# EAGLE design schemat (EAGLE 9.6.2)
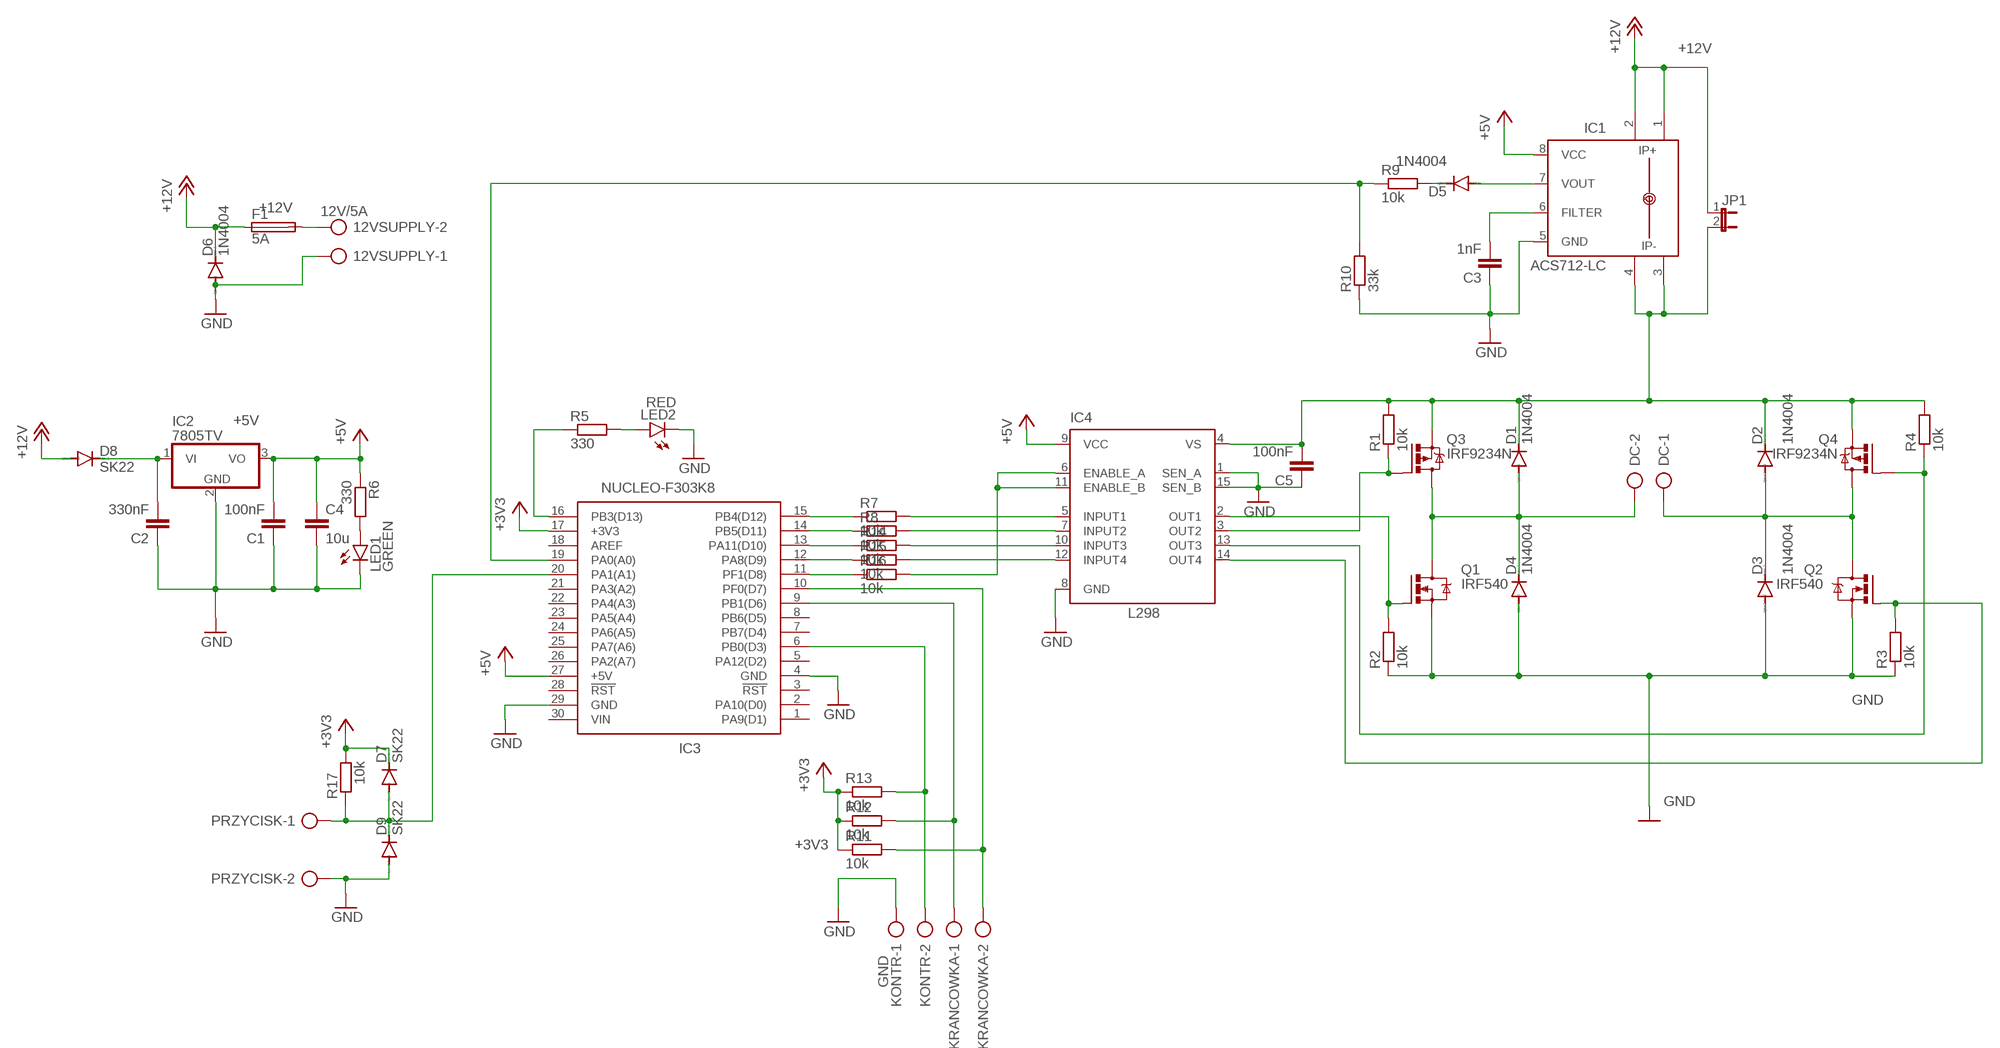
[diagram p0: schematic, sheet 1]

## Parts
12VSUPPLY  12V/5A  AK500/2-H  [AK500/2-H]
C1  100nF  C2.5/2  [C2.5-2]
C2  330nF  C2.5/2  [C2.5-2]
C3  1nF  C-EU025-024X044  [C025-024X044]
C4  10u  C-EU025-024X044  [C025-024X044]
C5  100nF  C2.5/2  [C2.5-2]
D1  1N4004  [DO41-10]
D2  1N4004  [DO41-10]
D3  1N4004  [DO41-10]
D4  1N4004  [DO41-10]
D5  1N4004  [DO41-10]
D6  1N4004  [DO41-10]
D7  SK22  ES2D  [SMB]
D8  SK22  ES2D  [SMB]
D9  SK22  ES2D  [SMB]
DC  AK500/2-H  [AK500/2-H]
F1  5A  TR5  [TR5]
IC1  ACS712-LC  [SOIC8]
IC2  7805TV  [TO220V]
IC3  NUCLEO-F303K8  [DIPS1524W66P254L5029H1500Q30N]
IC4  L298  [MULTIWATT-15]
JP1  JP1E  [JP1]
KONTR  GND  AK500/2-H  [AK500/2-H]
KRANCOWKA  AK500/2-H  [AK500/2-H]
LED1  GREEN  LED3MM  [LED3MM]
LED2  RED  LED3MM  [LED3MM]
PRZYCISK  AK500/2-H  [AK500/2-H]
Q1  IRF540  [TO220BV]
Q2  IRF540  [TO220BV]
Q3  IRF9234N  IRF9530  [TO220BV]
Q4  IRF9234N  IRF9530  [TO220BV]
R1  10k  R-EU_R1206  [R1206]
R2  10k  R-EU_R1206  [R1206]
R3  10k  R-EU_R1206  [R1206]
R4  10k  R-EU_R1206  [R1206]
R5  330  R-EU_R1206  [R1206]
R6  330  R-EU_R1206  [R1206]
R7  10k  R-EU_R1206  [R1206]
R8  10k  R-EU_R1206  [R1206]
R9  10k  R-EU_R1206  [R1206]
R10  33k  R-EU_R1206  [R1206]
R11  10k  R-EU_R1206  [R1206]
R12  10k  R-EU_R1206  [R1206]
R13  10k  R-EU_R1206  [R1206]
R14  10k  R-EU_R1206  [R1206]
R15  10k  R-EU_R1206  [R1206]
R16  10k  R-EU_R1206  [R1206]
R17  10k  R-EU_R1206  [R1206]

## Nets
+3V3: D7.C IC3.17(+3V3) R11.1 R12.1 R13.1 R17.2
+5V: C1.2 C4.1 IC1.8(VCC) IC2.3(VO) IC3.27(+5V) IC4.9(VCC) R6.1
+12V: D6.C D8.A F1.1 IC1.1(IP+) IC1.2(IP+1) JP1.1
GND: 12VSUPPLY.1 C1.1 C2.1 C3.1 C4.2 C5.1 D3.A D4.A D6.A D9.A IC1.5(GND) IC2.2(GND) IC3.4(GND) IC3.29(GND) IC4.1(SEN_A) IC4.8(GND) IC4.15(SEN_B) KONTR.1 LED1.K(C) LED2.K(C) PRZYCISK.2 Q1.S Q2.S R2.1 R3.1 R10.1
N$1: D2.A D3.C DC.1 Q2.D Q4.D
N$2: D1.A D4.C DC.2 Q1.D Q3.D
N$3: IC3.15(PB4(D12)) R7.1
N$4: IC4.5(INPUT1) R7.2
N$5: IC4.2(OUT1) Q1.G R2.2
N$6: IC4.14(OUT4) Q2.G R3.2
N$7: IC3.19(PA0(A0)) R9.1 R10.2
N$8: C2.2 D8.C IC2.1(VI)
N$9: IC4.3(OUT2) Q3.G R1.1
N$10: C5.2 D1.C D2.C IC1.3(IP-) IC1.4(IP-1) IC4.4(VS) JP1.2 Q3.S Q4.S R1.2 R4.2
N$11: IC4.13(OUT3) Q4.G R4.1
N$12: D5.A IC1.7(VOUT)
N$13: C3.2 IC1.6(FILTER)
N$14: D5.C R9.2
N$15: IC4.7(INPUT2) R8.2
N$16: IC3.14(PB5(D11)) R8.1
N$17: IC4.6(ENABLE_A) IC4.11(ENABLE_B) R16.2
N$19: IC3.6(PB0(D3)) KONTR.2 R13.2
N$20: IC3.9(PB1(D6)) KRANCOWKA.1 R12.2
N$21: IC3.10(PF0(D7)) KRANCOWKA.2 R11.2
N$22: LED1.A R6.2
N$23: IC3.13(PA11(D10)) R14.1
N$24: IC4.10(INPUT3) R14.2
N$25: IC4.12(INPUT4) R15.2
N$26: IC3.12(PA8(D9)) R15.1
N$27: IC3.11(PF1(D8)) R16.1
N$28: IC3.16(PB3(D13)) R5.1
N$29: LED2.A R5.2
N$31: 12VSUPPLY.2 F1.2
N$32: D7.A D9.C IC3.20(PA1(A1)) PRZYCISK.1 R17.1
Unconnected: IC3.1(PA9(D1)) IC3.2(PA10(D0)) IC3.3(!RST) IC3.5(PA12(D2)) IC3.7(PB7(D4)) IC3.8(PB6(D5)) IC3.18(AREF) IC3.21(PA3(A2)) IC3.22(PA4(A3)) IC3.23(PA5(A4)) IC3.24(PA6(A5)) IC3.25(PA7(A6)) IC3.26(PA2(A7)) IC3.28(!RST) IC3.30(VIN)

## Library data of the parts
12VSUPPLY DC KONTR KRANCOWKA PRZYCISK = con-ptr500:AK500/2-H: CONNECTOR Aug. 2004 / PTR Meßtechnik: Die Bezeichnung der Serie AK505 wurde geändert. Es handelt sich hierbei um AK500 in horizontaler Ausführung.; OC_FARNELL: unknown; OC_NEWARK: unknown
C1 C2 C5 = capacitor-wima:C: CAPACITOR naming: grid - package width
C3 C4 = rcl:C-EU: CAPACITOR, European symbol; SPICEPREFIX: C
D1-D6 = diode:1N4004: DIODE general purpose rectifier, 1 A
D7-D9 = diode:ES2D: DIODE super fast rectifier, 2 A
F1 = fuse:TR5: FUSE Wickmann; OC_FARNELL: unknown; OC_NEWARK: unknown
IC1 = allegro-2:ACS712-LC
IC2 = linear:78*: Positive VOLTAGE REGULATOR Source: http://cache.national.com/ds/LM/LM78L05.pdf http://www.fairchildsemi.com/ds/LM/LM7805.pdf
IC3 = NUCLEO-F303K8:NUCLEO-F303K8: STM32 Nucleo-32 development board Source: Datasheet <http://www.st.com/content/ccc/resource/technical/document/data_brief/b1/d8/13/d4/b0/b7/4b/6e/DM00214578.pdf/files/DM00214578.pdf/jcr:content/translations/en.DM00214578.pdf>; ARROW_PART_NUMBER: NUCLEO-F303K8; ARROW_PRICE-STOCK: https://www.arrow.com/en/products/nucleo-f303k8/stmicroelectronics; DESCRIPTION: STM32 Nucleo-32 development board; HEIGHT: 15mm; MANUFACTURER_NAME: STMicroelectronics; MANUFACTURER_PART_NUMBER: NUCLEO-F303K8; RS_PART_NUMBER: 9092862; RS_PRICE-STOCK: http://uk.rs-online.com/web/p/products/9092862
IC4 = st-microelectronics:L298: DUAL FULL-BRIDGE DRIVER; MPN: L298N; OC_FARNELL: 1589425; OC_NEWARK: 32M1527
JP1 = jumper:JP1E: JUMPER
LED1 LED2 = led:LED: LED OSRAM: - CHIPLED LG R971, LG N971, LY N971, LG Q971, LY Q971, LO R971, LY R971 LH N974, LH R974 LS Q976, LO Q976, LY Q976 LO Q996 - Hyper CHIPLED LW Q18S LB Q993, LB Q99A, LB R99A - SideLED LS A670, LO A670, LY A670, LG A670, LP A670 LB A673, LV A673, LT A673, LW A673 LH A674 LY A675 LS A676, LA A676, LO A676, LY A676, LW A676 LS A679, LY A679, LG A679 - Hyper Micro SIDELED® LS Y876, LA Y876, LO Y876, LY Y876 LT Y87S - SmartLED LW L88C, LW L88S LB L89C, LB L89S, LG L890 LS L89K, LO L89K, LY L89K LS L896, LA L896, LO L896, LY L896 - TOPLED LS T670, LO T670, LY T670, LG T670, LP T670 LSG T670, LSP T670, LSY T670, LOP T670, LYG T670 LG T671, LOG T671, LSG T671 LB T673, LV T673, LT T673, LW T673 LH T674 LS T676, LA T676, LO T676, LY T676, LB T676, LH T676, LSB T676, LW T676 LB T67C, LV T67C, LT T67C, LS T67K, LO T67K, LY T67K, LW E67C LS E67B, LA E67B, LO E67B, LY E67B, LB E67C, LV E67C, LT E67C LW T67C LS T679, LY T679, LG T679 LS T770, LO T770, LY T770, LG T770, LP T770 LB T773, LV T773, LT T773, LW T773 LH T774 LS E675, LA E675, LY E675, LS T675 LS T776, LA T776, LO T776, LY T776, LB T776 LHGB T686 LT T68C, LB T68C - Hyper Mini TOPLED® LB M676 - Mini TOPLED Santana® LG M470 LS M47K, LO M47K, LY M47K Source: http://www.osram.convergy.de LUXEON: - LUMILED® LXK2-PW12-R00, LXK2-PW12-S00, LXK2-PW14-U00, LXK2-PW14-V00 LXK2-PM12-R00, LXK2-PM12-S00, LXK2-PM14-U00 LXK2-PE12-Q00, LXK2-PE12-R00, LXK2-PE12-S00, LXK2-PE14-T00, LXK2-PE14-U00 LXK2-PB12-K00, LXK2-PB12-L00, LXK2-PB12-M00, LXK2-PB14-N00, LXK2-PB14-P00, LXK2-PB14-Q00 LXK2-PR12-L00, LXK2-PR12-M00, LXK2-PR14-Q00, LXK2-PR14-R00 LXK2-PD12-Q00, LXK2-PD12-R00, LXK2-PD12-S00 LXK2-PH12-R00, LXK2-PH12-S00 LXK2-PL12-P00, LXK2-PL12-Q00, LXK2-PL12-R00 Source: www.luxeon.com KINGBRIGHT: KA-3528ASYC Source: www.kingbright.com
Q1 Q2 = transistor-power:IRF540: HEXFET Power MOSFET
Q3 Q4 = transistor-power:IRF9530: P-CHANNEL HEXFET POWER-MOS-FET Source: http://www.irf.com/product-info/datasheets/data/irf9530.pdf
R1-R17 = rcl:R-EU_: RESISTOR, European symbol; SPICEPREFIX: R

## Board
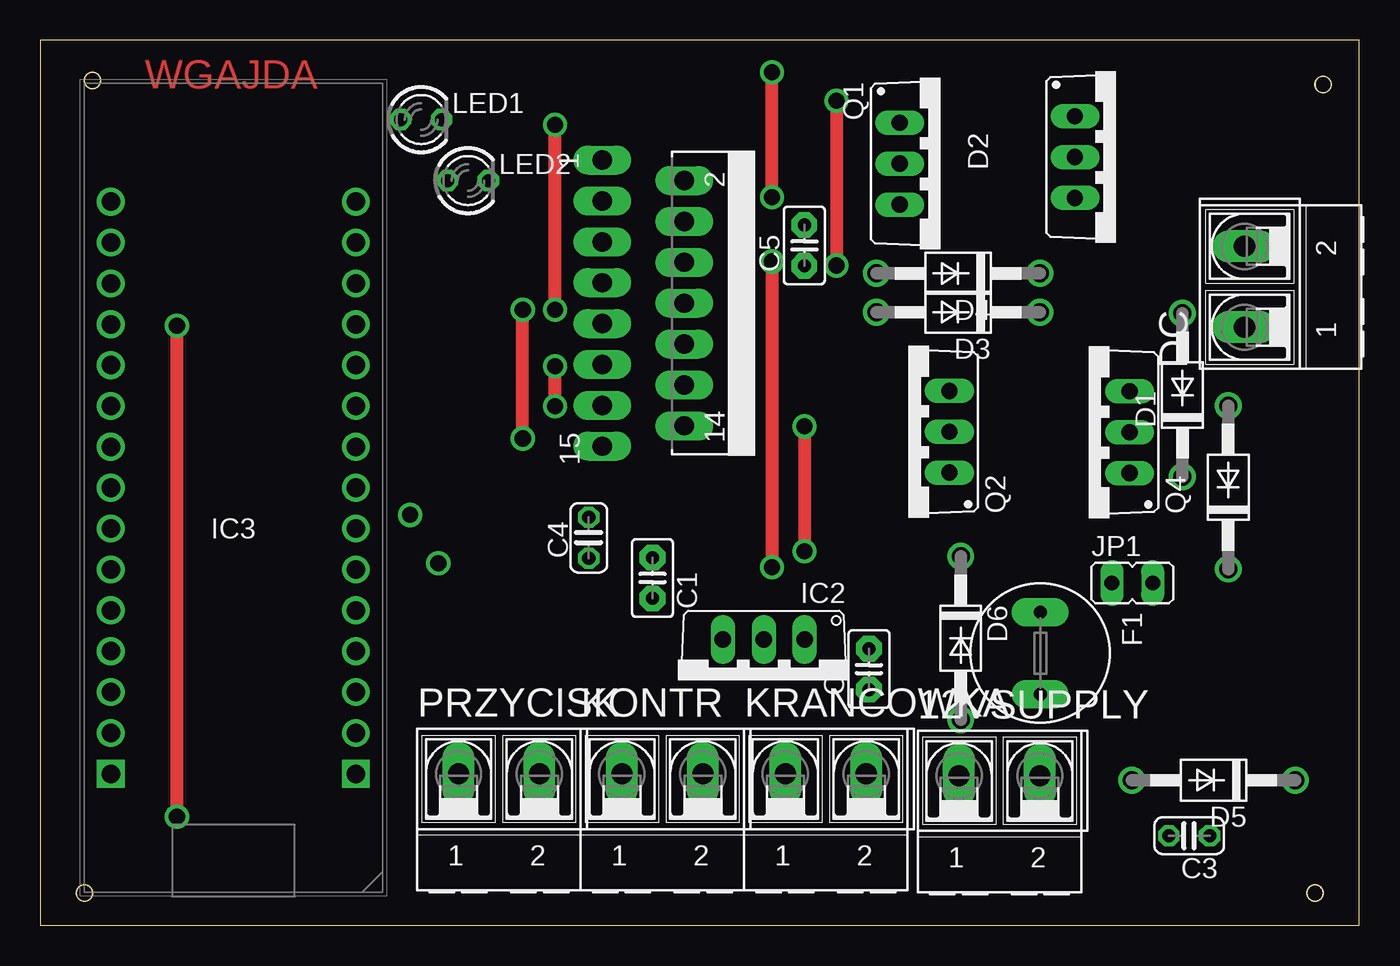
[diagram p1: board, top side]
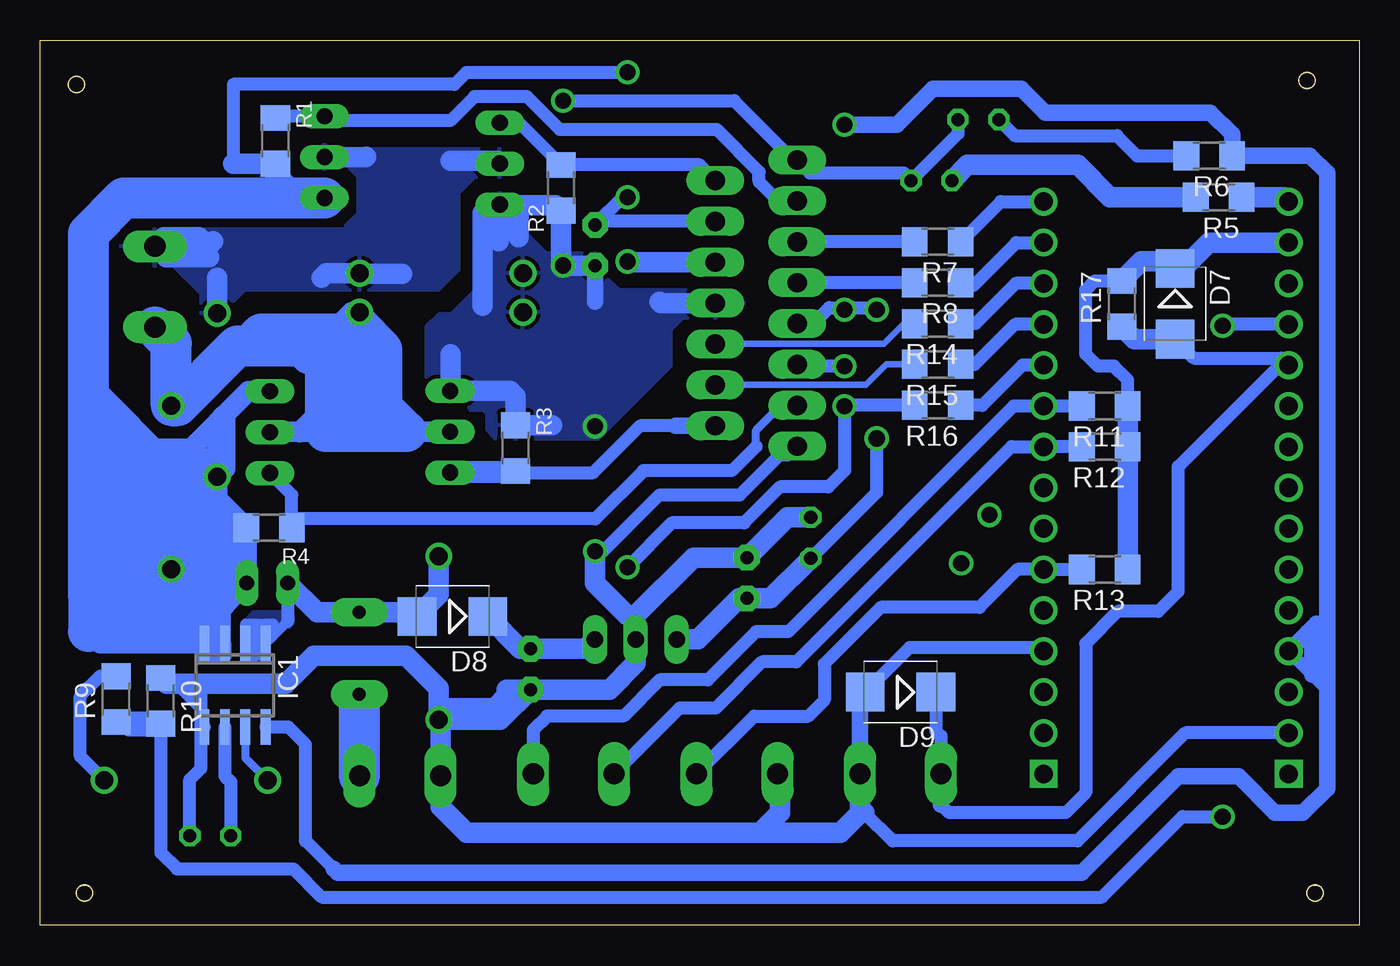
[diagram p2: board, bottom side, seen from below]

Size 82 x 55 mm. Coordinates in mm from the lower left corner, seen from the top.
Outline: 79.25,52.22 arc174 80.25,52.22 80.25,52.28 arc174 79.25,52.28 79.25,52.22
Outline: 78.75,1.97 arc174 79.75,1.97 79.75,2.03 arc174 78.75,2.03 78.75,1.97
Outline: 2.25,1.97 arc174 3.25,1.97 3.25,2.03 arc174 2.25,2.03 2.25,1.97
Outline: 2.75,52.47 arc174 3.75,52.47 3.75,52.53 arc174 2.75,52.53 2.75,52.47
Outline: 0,55 0,0 82,0 82,55 0,55
Copper layers (1*16): Top 0.035mm / dielectric 1.5mm / Bottom 0.035mm
Design rules "default *": minimum track width 6mil, minimum drill 0.35mm, track to track 2mil, track to pad 2mil, pad to pad 2mil, via to via 2mil, smd to smd 2mil, copper to edge 40mil, drill to drill 6mil, minimum pad ring 10mil, minimum via ring 8mil, stop-mask expansion 4mil, vias tented up to drill 0mil, thermal gap 10mil
Holes 1 mm at 2.75,2 3.25,52.5 79.75,52.25 79.25,2

### Footprints (pad centres in the part's own frame; a part is rotated, then mirrored left to right if it is on the bottom)
AK500/2-H = drill 1.321 long: 1 -2.515,0; 2 2.515,0
C2.5-2 = drill 0.813 pad 1.6 octagon: 1 -1.27,0; 2 1.27,0
C025-024X044 = drill 0.813 octagon: 1 -1.27,0; 2 1.27,0
DO41-10 = drill 1.118: A 5.08,0; C -5.08,0
SMB = smd 2.4 x 2.4: A 2.2,0; C -2.2,0
TR5 = drill 0.813 pad 1.778 long: 1 -2.54,0; 2 2.54,0
SOIC8 = smd 0.6 x 2.2: 1 -1.905,-2.6; 2 -0.635,-2.6; 3 0.635,-2.6; 4 1.905,-2.6; 5 1.905,2.6; 6 0.635,2.6; 7 -0.635,2.6; 8 -1.905,2.6
TO220V = drill 1.016 long: 1 -2.54,-2.54; 2 0,-2.54; 3 2.54,-2.54
DIPS1524W66P254L5029H1500Q30N = drill 1.15 pad 1.725 square: 1 -7.62,17.78; 30 7.62,17.78 | drill 1.15 pad 1.725: 2 -7.62,15.24; 3 -7.62,12.7; 4 -7.62,10.16; 5 -7.62,7.62; 6 -7.62,5.08; 7 -7.62,2.54; 8 -7.62,0; 9 -7.62,-2.54; 10 -7.62,-5.08; 11 -7.62,-7.62; 12 -7.62,-10.16; 13 -7.62,-12.7; 14 -7.62,-15.24; 15 -7.62,-17.78; 16 7.62,-17.78; 17 7.62,-15.24; 18 7.62,-12.7; 19 7.62,-10.16; 20 7.62,-7.62; 21 7.62,-5.08; 22 7.62,-2.54; 23 7.62,0; 24 7.62,2.54; 25 7.62,5.08; 26 7.62,7.62; 27 7.62,10.16; 28 7.62,12.7; 29 7.62,15.24
MULTIWATT-15 = drill 1.2 long: 1 -8.89,-7.62; 2 -7.62,-2.54; 3 -6.35,-7.62; 4 -5.08,-2.54; 5 -3.81,-7.62; 6 -2.54,-2.54; 7 -1.27,-7.62; 8 0,-2.54; 9 1.27,-7.62; 10 2.54,-2.54; 11 3.81,-7.62; 12 5.08,-2.54; 13 6.35,-7.62; 14 7.62,-2.54; 15 8.89,-7.62
JP1 = drill 0.914 long: 1 0,-1.27; 2 0,1.27
LED3MM = drill 0.813 octagon: A -1.27,0; K 1.27,0
TO220BV = drill 1.016 long: D 0,-2.54; G -2.54,-2.54; S 2.54,-2.54
R1206 = smd 1.6 x 1.803: 1 -1.422,0; 2 1.422,0

### Placement (x,y rotation side)
12VSUPPLY  59.63,9.29 0 top
C1  38.06,21.58 270 top
C2  51.52,15.92 90 top
C3  71.43,5.57 180 top
C4  34.1,24.08 90 top
C5  47.5,42.25 90 top
D1  71.01,32.95 90 top
D2  73.85,27.22 90 top
D3  57.06,38.1 180 top
D4  57.06,40.51 180 top
D5  72.95,9.02 180 top
D6  57.22,17.84 270 top
D7  11.45,38.62 270 bottom
D8  56.37,19.19 180 bottom
D9  28.52,14.49 180 bottom
DC  74.87,39.68 90 top
F1  62.17,16.91 270 top
IC1  69.89,14.92 180 bottom
IC2  44.98,15.23 180 top
IC3  12.01,27.19 180 top
IC4  42.57,38.66 270 top
JP1  67.89,21.27 270 top
KONTR  38.68,9.41 0 top
KRANCOWKA  48.84,9.41 0 top
LED1  23.68,50.07 0 top
LED2  26.59,46.28 0 top
PRZYCISK  28.52,9.41 0 top
Q1  55.97,47.33 270 top
Q2  53.98,30.67 90 top
Q3  66.86,47.74 270 top
Q4  65.18,30.64 90 top
R1  67.38,48.74 270 bottom
R2  49.62,45.83 90 bottom
R3  52.46,29.65 270 bottom
R4  67.78,24.71 180 bottom
R5  8.74,45.24 180 bottom
R6  9.33,47.82 180 bottom
R7  26.21,42.47 180 bottom
R8  26.21,39.93 180 bottom
R9  77.29,14.06 90 bottom
R10  74.51,13.95 270 bottom
R11  15.82,32.27 180 bottom
R12  15.82,29.73 180 bottom
R13  15.82,22.11 180 bottom
R14  26.21,37.39 180 bottom
R15  26.21,34.85 180 bottom
R16  26.21,32.31 180 bottom
R17  14.76,38.62 90 bottom

### Tracks (layer width: path | path; a pad name or v marks a point on that pad's centre or on a via)
+3V3
  Bottom 0.813: R11.1 14.4,33.9 15.25,34.75 16.25,34.75 17,35.5 17,39.5 16.46,40.04 R17.2
  Bottom 1.27: R17.2 13.55,41.25 11.88,41.25 D7.C 10.95,40.82 9.34,42.43 IC3.17 | R11.1 R12.1 R13.1
+5V  (via drill 1 pad 0.95)
  Top 0.813: v32,38.25 v32,49.75 | v30,30.25 v30,38.25
  Bottom 0.406: 31.5,38.39 31.5,38.25 32,37.75 v32,38.25
  Bottom 0.813: v30,38.25 30.14,38.39 31.5,38.39 32.95,38.39 33.95,37.39 IC4.9 | C4.1 30,26.91 v30,30.25 | 63.75,3.5 65.5,5.25 65.5,11.25 66.57,12.32 IC1.8 | 2,14.25 2,14.64 2.93,15.57 IC3.27
  Bottom 1.016: v32,49.75 28.75,49.75 26.5,52 21,52 19.5,50.5 9.25,50.5 7.91,49.16 R6.1 3.07,47.82 2,46.75 2,18.75 | 2,18.75 2,14.25 2,8.5 3.5,7 5.25,7 7.5,9.25 11.25,9.25 17.25,3.25 63.5,3.25 63.75,3.5 | IC3.27 3.21,18.21 | 3.21,18.21 2.67,18.75 2,18.75 | 2.93,15.57 2.93,17.93 3.21,18.21
  Bottom 1.27: IC2.3 41.1,17.77 38.56,20.31 C1.2 36.6,20.31 C4.1
+12V
  Bottom 0.61: 66.62,18.89 IC1.1 67.5,18 67.5,18.75 68,18.75 | 68.5,18.75 69,18.75 | 69,18.75 69.25,18.75 69.25,16.75 69,16.75 | 68.5,16.75 68,16.75 68,18.75 | 68.5,18.75 68,18.75 | 68.5,16.75 68.5,18.75 | 69,16.75 68.5,16.75 | 69,18.75 69,16.75
  Bottom 0.813: JP1.1 66.62,18.89
  Bottom 1.27: D6.C 57.22,20.54 D8.A 58.83,19.45 F1.1 64.8,19.45 JP1.1
  pour Bottom: 67.75,16.5 69.5,16.5 69.5,18.75 68.75,19.5 66.5,19.5 66.25,19.25 66.25,18.75 66.5,18.5 66.75,18.5 67.75,17.5
GND  (via drill 1 pad 0.95)
  Top 0.813: v49.5,51.25 v49.5,41 | v47.5,31 v47.5,23.25
  Bottom 0.813: IC3.4 19.85,17.25 27.96,17.25 D9.A | IC3.29 10.8,11.95 17.5,5.25 29,5.25 30.75,7 | v49.5,51.25 38.87,51.25 35.16,47.55 IC4.1 34.15,46.75 28.33,46.75 LED2.K 24.95,49.19 LED1.K | IC4.15 35.47,29.25 36,29.25 38.5,26.75 43.5,26.75 47,23.25 v47.5,23.25 | C3.1 72.7,9.05 72,9.75 72,12.12 | 72,12.12 72,12.53 | 72,12.53 72,13.5 | 72,13.5 72,14.5 72.5,15 | 72,12.12 IC1.5 72,12.53 | 72,13.5 73.5,15 74.14,15
  Bottom 1.016: D9.A 31.04,14.18 PRZYCISK.2 31.04,8.5 | C5.1 47.5,38.75
  Bottom 1.27: D6.A 57.12,12.65 12VSUPPLY.1 57.12,7.37 55.5,5.75 37.25,5.75 | D6.A 53.41,12.76 C2.1 | 44.98,19.27 IC2.2 44.98,16.27 46.6,14.65 C2.1 | 44.98,19.27 41.4,22.85 C1.1 35.56,25.35 C4.2 | R10.1 74.14,15 72.5,15 66.75,15 65,16.75 59.25,16.75 57.22,14.72 D6.A | C2.1 53,14.65 53,14.25 53.75,13.5 56.48,13.5 D6.A | 37.25,5.75 36,7 36,9.24 KONTR.1 | 37.25,5.75 32.25,5.75 31.04,6.96 31.04,8.5 | v47.5,23.25 47.5,21.25 45.52,19.27 44.98,19.27 | Q1.S 53.5,44.72 53.5,42.5 | Q1.S 53.39,44.75 52.5,44.75 | 52.5,44.75 52.25,44.5 52.25,42.75 | Q1.S 53.96,44.79 54.5,44.25 54.5,38.5 | IC4.8 43.41,38.66 43.5,38.75 | 56.5,35.5 56.5,33.23 Q2.S 52.79,33.21 52.46,32.88 R3.1 50.18,31.07 | C5.1 47.52,41 v49.5,41 49.62,41.12 R2.1 49.96,44.75 52.5,44.75 | 30.75,7 31.04,7.29 PRZYCISK.2
  pour Bottom: 39,39.5 46,39.5 46.75,40.25 46.75,41.25 47.25,41.75 50.5,41.75 51.75,43 51.75,45 52.25,45.5 54.25,45.5 54.75,45 54.75,39.75 56.5,38 57.25,38 58,37.25 58,33.25 57.25,32.5 55.75,32.5 55.25,32 54.5,32 54.25,31.75 54.25,30.75 53.75,30.25 47.25,30.25 42.75,34.75 42.75,37 42,37.75 39,37.75 38.25,38.5 38.25,38.75
N$1
  Bottom 1.016: Q2.D 58.67,30.67 | 62.25,34.25 62.25,37.25 62.25,37.99 D3.C | 65.86,30.64 Q4.D
  Bottom 1.27: Q2.D 59.25,30.67 62,30.67 | 62,30.67 62.5,30.67 | 64.25,30.67 67.69,30.67 Q4.D | 62,30.67 62,36.75 62,37.96 D3.C 62.65,38.1 65.25,35.5 | 58.67,30.67 60.75,32.75 62.25,34.25 65.86,30.64
  Bottom 2.54: 62.5,30.67 59.25,30.67 64.08,35.5 | 62.5,30.67 64.25,30.67 64.25,35.33 64.08,35.5 | 64.08,35.5 65.25,35.5 | 62.5,30.67 62.5,36 | 62.5,36 63.25,36.75 64.08,35.92 | 64.08,35.5 64.08,35.92 | 60.75,32.75 60.75,35.75 62.25,37.25 | 64.08,35.92 64.66,36.5 68.5,36.5 68.25,36.75 62,36.75 | 62.5,36 69.75,36 73.45,32.3 D2.A 73.85,36.15 DC.1
N$2
  Bottom 1.27: 71.25,42.5 71.56,42.2 72.11,42.75 74.31,42.75 DC.2 74.17,41.5 71.5,41.5 | D1.A 71,40.25 | 64.5,40.25 64.24,40.51 D4.C 59.5,40.5 | Q3.D 61.76,47.74 61.75,47.75 | Q1.D 53.6,47.5 56.5,47.5
  pour Bottom: 52.5,48.25 63.25,48.25 63.5,48.5 65,48.5 65.75,47.75 65,47 62.75,47 62.25,46.5 62.25,44.25 63,43.5 63,43.25 76.25,43.25 77,42.5 77,41.75 76.25,41 73.75,41 72,39.25 72,38 71.25,37.25 70.75,37.25 70.25,37.75 70.25,38.5 69.25,39.5 57.25,39.5 56,40.75 56,45.5 55,46.5 52.25,46.5 52,46.75 52,47.75
N$3
  Bottom 0.813: R7.1 22.28,44.97 IC3.15
N$4
  Bottom 0.813: R7.2 IC4.5
N$5
  Bottom 0.813: IC4.2 41,47.25 R2.2 52.24,49.87 Q1.G
N$6
  Bottom 0.813: 42.5,31.04 44.71,31.04 47.62,28.13 53,28.13
  Bottom 1.016: IC4.14 42.5,31.04
  Bottom 1.27: R3.2 57.02,28.23 57.25,28 56.65,28 Q2.G 53,28.13
N$7  (via drill 1)
  Top 0.813: v8.5,6.75 v8.5,37.25
  Bottom 0.813: R9.1 76.5,12.64 76.5,12.14 74.9,12.14 | 74.9,12.14 74.5,12.14 74.5,4.5 73.5,3.5 66.25,3.5 64.5,1.75 16,1.75 11,6.75 v8.5,6.75 | 74.9,12.14 R10.2 | IC3.19 8.4,37.35 v8.5,37.25
  Bottom 1.27: R10.2 74.62,12.64 R9.1
N$8
  Bottom 1.27: D8.C 52.17,17.19 C2.2 48.1,17.19 IC2.1
N$9
  Bottom 0.813: IC4.3 36.12,45.01 37.31,46.2 37.31,46.81 39.94,49.44 49.69,49.44 51.75,51.5 55,51.5 56.5,50 64.04,50 Q3.G 67.26,50.28 R1.1
N$10  (via drill 1 pad 0.95)
  Top 0.813: v45.5,45.25 v45.5,53
  Bottom 0.813: IC4.4 47.28,43.74 C5.2 45.77,45.25 v45.5,45.25 | v45.5,53 55.5,53 56.25,52.25 70,52.25 70,47.32 | 71.03,16.75 70.5,16.75 70.53,16.77 IC1.3 70.53,19.52 70.72,19.71 | 71.03,16.75 IC1.4 72,17.32 72,16.75 71.03,16.75
  Bottom 1.016: IC1.4 71.25,17.52
  Bottom 1.27: IC1.4 71.8,18.64 | 71.8,18.64 71.25,19.18 | 71.25,19.18 70.72,19.71 70.22,20.21 | 70.22,20.21 JP1.2 69.16,24.67 R4.2 70.22,25.72 | 71.25,17.52 71.25,19.18 | D1.C 71.01,26.52 70.22,25.72 | D1.C 71.01,29 | 71.01,29 71.01,31.24 | Q4.S 69.07,33.18 70.5,31.75 | 71.01,31.24 70.5,31.75 | 71.25,19.18 71.25,19.54 | 71.25,19.54 D2.C | 71.01,29 72,29 | 72,29 74.25,29 74.88,29.62 | 74.88,29.62 77.62,32.38 | 77.62,32.38 79,33.75 | Q3.S 65.88,45.2 68,47.32 R1.2 70,47.32 | 79,33.75 79,23.25 | 77.25,17.52 78.27,17.52 79,18.25 | IC1.4 77.25,17.52 | 71.01,31.24 72.75,29.5 | 75.25,27 72.75,29.5 | 75.25,27 75.62,26.62 | 79,23.25 77.5,24.75 | 77.5,24.75 76.75,25.5 76.62,25.62 | 79,23.25 79,22 | 77.62,32.38 78,32 78,23.75 | 78,23.75 78,22.25 | 78,22.25 78,20.75 | 78,20.75 78,19.5 | 78,19.5 78,18 77,18 | 77,18 72.43,18 71.8,18.64 | 70.22,20.21 70.22,25.72 | 70.22,25.72 70.31,25.62 71.25,25.62 | 71.25,25.62 72.5,25.62 | 72.5,25.62 72.75,25.62 | 72.75,25.62 73.75,25.62 | 73.75,25.62 74.5,25.62 | 74.5,25.62 75.75,25.62 | 76.62,25.62 76,25.62 | 76,25.62 75.75,25.62 | 76.62,25.62 76.62,24.5 | 76.62,24.5 76.62,18.38 77,18 | 77.25,17.52 76.14,18.64 71.8,18.64 | IC1.4 71.8,19.5 | 71.8,19.5 71.8,21 | 71.8,21 71.8,25.08 | 71.8,25.08 71.25,25.62 | 71.8,25.08 71.25,24.54 71.25,19.54 | 71.8,19.5 72.75,19.5 | 72.75,19.5 73.5,19.5 | 73.5,19.5 74.5,19.5 | 74.5,19.5 75.5,19.5 | 75.5,19.5 78,19.5 | 77.25,17.52 77.5,17.77 77.5,23.25 | 75.62,29.38 77.25,31 77.5,31.25 77.5,26.25 | 75.62,29.38 74,27.75 | 74,27.75 72.75,26.5 | 72.5,26.25 72.5,25.62 | 77.5,24.75 77.5,26.25 | 71.25,25.62 71.88,26.25 | 71.88,26.25 72.5,26.25 | 72.5,26.25 74.5,26.25 | 74.5,26.25 77.5,26.25 | 75.62,29.38 75.62,26.62 | 75.62,26.62 76.62,25.62
  Bottom 1.27: 75.25,27 74.5,26.25 | 74,27.75 74,26.75 74.5,26.25 | 72.75,29.5 72.75,26.5 | 72.75,26.5 72.5,26.25 | 72,29 72,26.38 71.88,26.25 | 72.75,25.62 72.75,24 | 72.75,24 72.75,22 | 72.75,22 72.75,19.5 | 73.75,25.62 73.75,23.75 | 73.75,21 73.75,19.75 73.5,19.5 | 75.5,19.5 75.75,19.75 75.75,25.62 | 78,20.75 76,20.75 | 76,20.75 73.5,20.75 | 73.5,20.75 72.05,20.75 71.8,21 | 78,22.25 73,22.25 72.75,22 | 78,23.75 73.75,23.75 | 73.75,23.75 73,23.75 72.75,24 | 73.75,23.75 73.75,21 | 73.75,21 73.5,20.75 | 74.5,25.62 74.5,19.5 | 76,25.62 76,20.75 | 77.5,24.75 77.5,23.62 | 77.5,23.25 78,23.75 | 77.5,23.25 77.5,23.62 | 77.5,23.62 76.62,24.5 | 72.75,29.5 72.88,29.62 74.88,29.62 | 79,43 79,33.75 | D1.C 70.5,28.38 70.5,31.75
  Bottom 2.54: 77.25,31 77.25,26 76.75,25.5 | 78,19.5 79,20.5 | 79,20.5 79,22 79,43 76.8,45.2 Q3.S | 79,20.5 79,18.25
N$11
  Bottom 0.508: IC4.13 35.51,31.75 36.5,31.75 37.5,30.75 37.5,29.75
  Bottom 0.813: 37.5,29.75 39,28.25 44.5,28.25 47.5,25.25 66.5,25.25 66.5,24.85 R4.1 66.36,26.74 Q4.G
N$12
  Bottom 0.508: IC1.7 69.25,10.4 D5.A
N$13
  Bottom 0.813: IC1.6 70.53,9.28 70.16,8.91 C3.2
N$14
  Bottom 0.813: D5.C 79.5,10.49 79.5,14.25 78.27,15.48 R9.2
N$15
  Bottom 0.813: R8.2 IC4.7
N$16
  Bottom 0.813: R8.1 24.18,39.93 24,39.75 21.32,42.43 IC3.14
N$17  (via drill 1 pad 0.95)
  Top 0.813: v32,32.25 v32,34.75 | v45.5,41.25 v45.5,22.25
  Bottom 0.254: 35.04,34.94 IC4.11
  Bottom 0.813: R16.2 31.94,32.31 v32,32.25 32,28.25 33,27.25 36,27.25 38.25,25 42.75,25 v45.5,22.25 | v32,34.75 35.04,34.75 35.04,34.94
  Bottom 1.27: IC4.6 45.45,41.2 v45.5,41.25
N$18  (via drill 1)
  other vias: 23,25.5
N$19
  Bottom 0.813: R13.2 IC3.6 21.25,22.11 23.61,19.75 29.75,19.75 33.25,16.25 33.25,14 34.25,13 37.6,13 KONTR.2
N$20
  Bottom 0.813: R12.2 IC3.9 20.02,29.73 20.04,29.75 21.62,29.75 35,16.38 37.12,16.38 40,13.5 42.25,13.5 42.25,13.48 KRANCOWKA.1
N$21
  Bottom 0.813: R11.2 IC3.10 21.48,32.27 35.5,18.25 37.5,18.25 40.5,15.25 43.5,15.25 45.75,13 50.5,13 51.35,12.14 KRANCOWKA.2
N$22
  Bottom 0.813: R6.2 13.82,47.82 15.07,49.07 21.41,49.07 LED1.A
N$23
  Bottom 0.813: IC3.13 21.36,39.89 23.86,37.39 R14.1
N$24
  Bottom 0.406: R14.2 28.3,37.39 29.55,36.13 40.02,36.13 IC4.10
N$25
  Bottom 0.406: R15.2 29.4,34.85 30.67,33.58 IC4.12
N$26
  Bottom 0.813: IC3.12 21.4,37.35 23.9,34.85 R15.1
N$27
  Bottom 0.813: IC3.11 20.94,34.81 23.44,32.31 R16.1
N$28
  Bottom 1.27: IC3.16 4.66,45.24 R5.1
N$29
  Bottom 1.27: R5.2 10.17,45.25 15.5,45.25 17.5,47.25 24.35,47.25 LED2.A
N$30  (via drill 1)
  other vias: 24.75,22.5
N$31
  Bottom 1.27: 62.15,13.5 62.15,14.35 F1.2
  Bottom 2.54: 12VSUPPLY.2 62.15,13.5
N$32
  Bottom 0.813: D7.A 10.28,35.25 4.83,35.25 IC3.20 4.94,34.81 11.25,28.5 11.25,20.75 12.5,19.5 15,19.5 17,17.5 17,8.25 18.25,7 25.5,7 26,7.5 | D9.C 26.32,12.07 26,11.75 PRZYCISK.1
  Bottom 1.016: PRZYCISK.1 26,7.5
  Bottom 1.27: D7.A 13.98,36.42 R17.1

### Text on the board
Top: WGAJDA